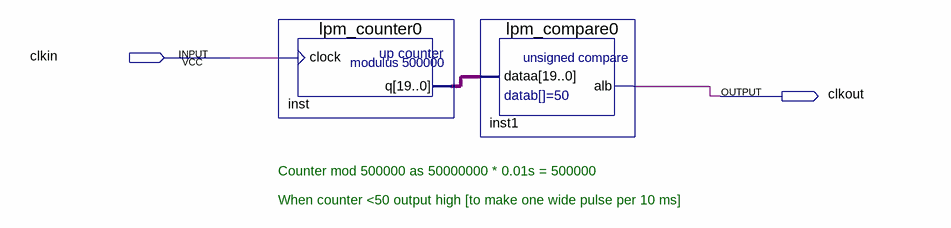
[diagram p0: schematic sheet]
// Quartus schematic clockdivide.bdf as structural Verilog: 2 symbols, 2 pins
module clockdivide (
  input  clkin,
  output clkout
);

  wire [19:0] inst_q;

  lpm_counter0 inst (.clock(clkin), .q(inst_q));
  lpm_compare0 inst1 (.dataa(inst_q), .alb(clkout));

  // Notes on the sheet:
  //   Counter mod 500000 as 50000000 * 0.01s = 500000
  //   When counter <50 output high [to make one wide pulse per 10 ms]
endmodule
